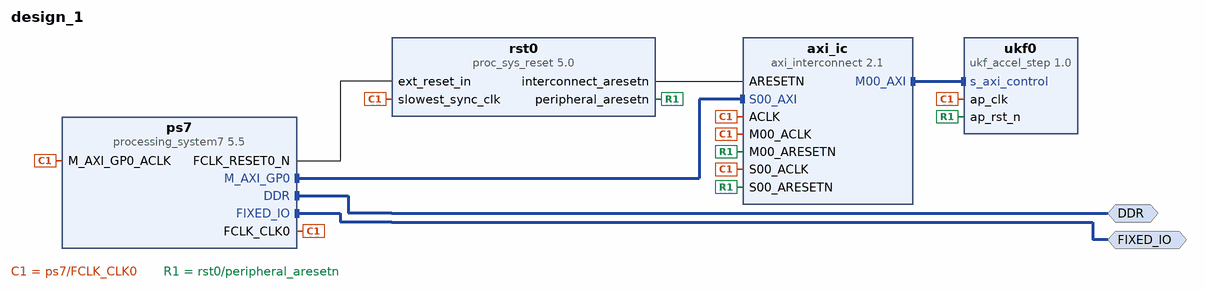
[diagram p0: block diagram of the top level]
# Vivado block design design_1, xc7z020clg484-1, Vivado 2024.2
create_bd_design design_1

create_bd_intf_port -mode Master -vlnv xilinx.com:interface:ddrx_rtl:1.0 DDR
create_bd_intf_port -mode Master -vlnv xilinx.com:display_processing_system7:fixedio_rtl:1.0 FIXED_IO

create_bd_cell -type ip -vlnv xilinx.com:ip:processing_system7:5.5 ps7
set_property -dict {CONFIG.PCW_USE_FABRIC_INTERRUPT 1} [get_bd_cells ps7]
# 2 more settings of ps7 are not shown: defaults, MIO pin electricals, DDR timing, and values the tool derives
create_bd_cell -type ip -vlnv xilinx.com:ip:axi_interconnect:2.1 axi_ic
set_property -dict {CONFIG.NUM_MI 1 CONFIG.NUM_SI 1} [get_bd_cells axi_ic]
create_bd_cell -type ip -vlnv xilinx.com:hls:ukf_accel_step:1.0 ukf0
create_bd_cell -type ip -vlnv xilinx.com:ip:proc_sys_reset:5.0 rst0

# ---- connections ----

connect_bd_intf_net [get_bd_intf_pins axi_ic/M00_AXI] [get_bd_intf_pins ukf0/s_axi_control]
connect_bd_intf_net [get_bd_intf_ports DDR] [get_bd_intf_pins ps7/DDR]
connect_bd_intf_net [get_bd_intf_ports FIXED_IO] [get_bd_intf_pins ps7/FIXED_IO]
connect_bd_intf_net [get_bd_intf_pins ps7/M_AXI_GP0] [get_bd_intf_pins axi_ic/S00_AXI]
connect_bd_net [get_bd_pins ps7/FCLK_CLK0] \
  [get_bd_pins rst0/slowest_sync_clk] [get_bd_pins ps7/M_AXI_GP0_ACLK] [get_bd_pins axi_ic/ACLK] \
  [get_bd_pins axi_ic/S00_ACLK] [get_bd_pins axi_ic/M00_ACLK] [get_bd_pins ukf0/ap_clk]
connect_bd_net [get_bd_pins ps7/FCLK_RESET0_N] [get_bd_pins rst0/ext_reset_in]
connect_bd_net [get_bd_pins rst0/interconnect_aresetn] [get_bd_pins axi_ic/ARESETN]
connect_bd_net [get_bd_pins rst0/peripheral_aresetn] [get_bd_pins axi_ic/S00_ARESETN] [get_bd_pins axi_ic/M00_ARESETN] [get_bd_pins ukf0/ap_rst_n]

# ---- address map ----
assign_bd_address -offset 0x40000000 -range 64K -target_address_space [get_bd_addr_spaces ps7/Data] [get_bd_addr_segs ukf0/s_axi_control/Reg]

validate_bd_design
save_bd_design
